# EAGLE design Badge Proto (EAGLE 9.2.2)
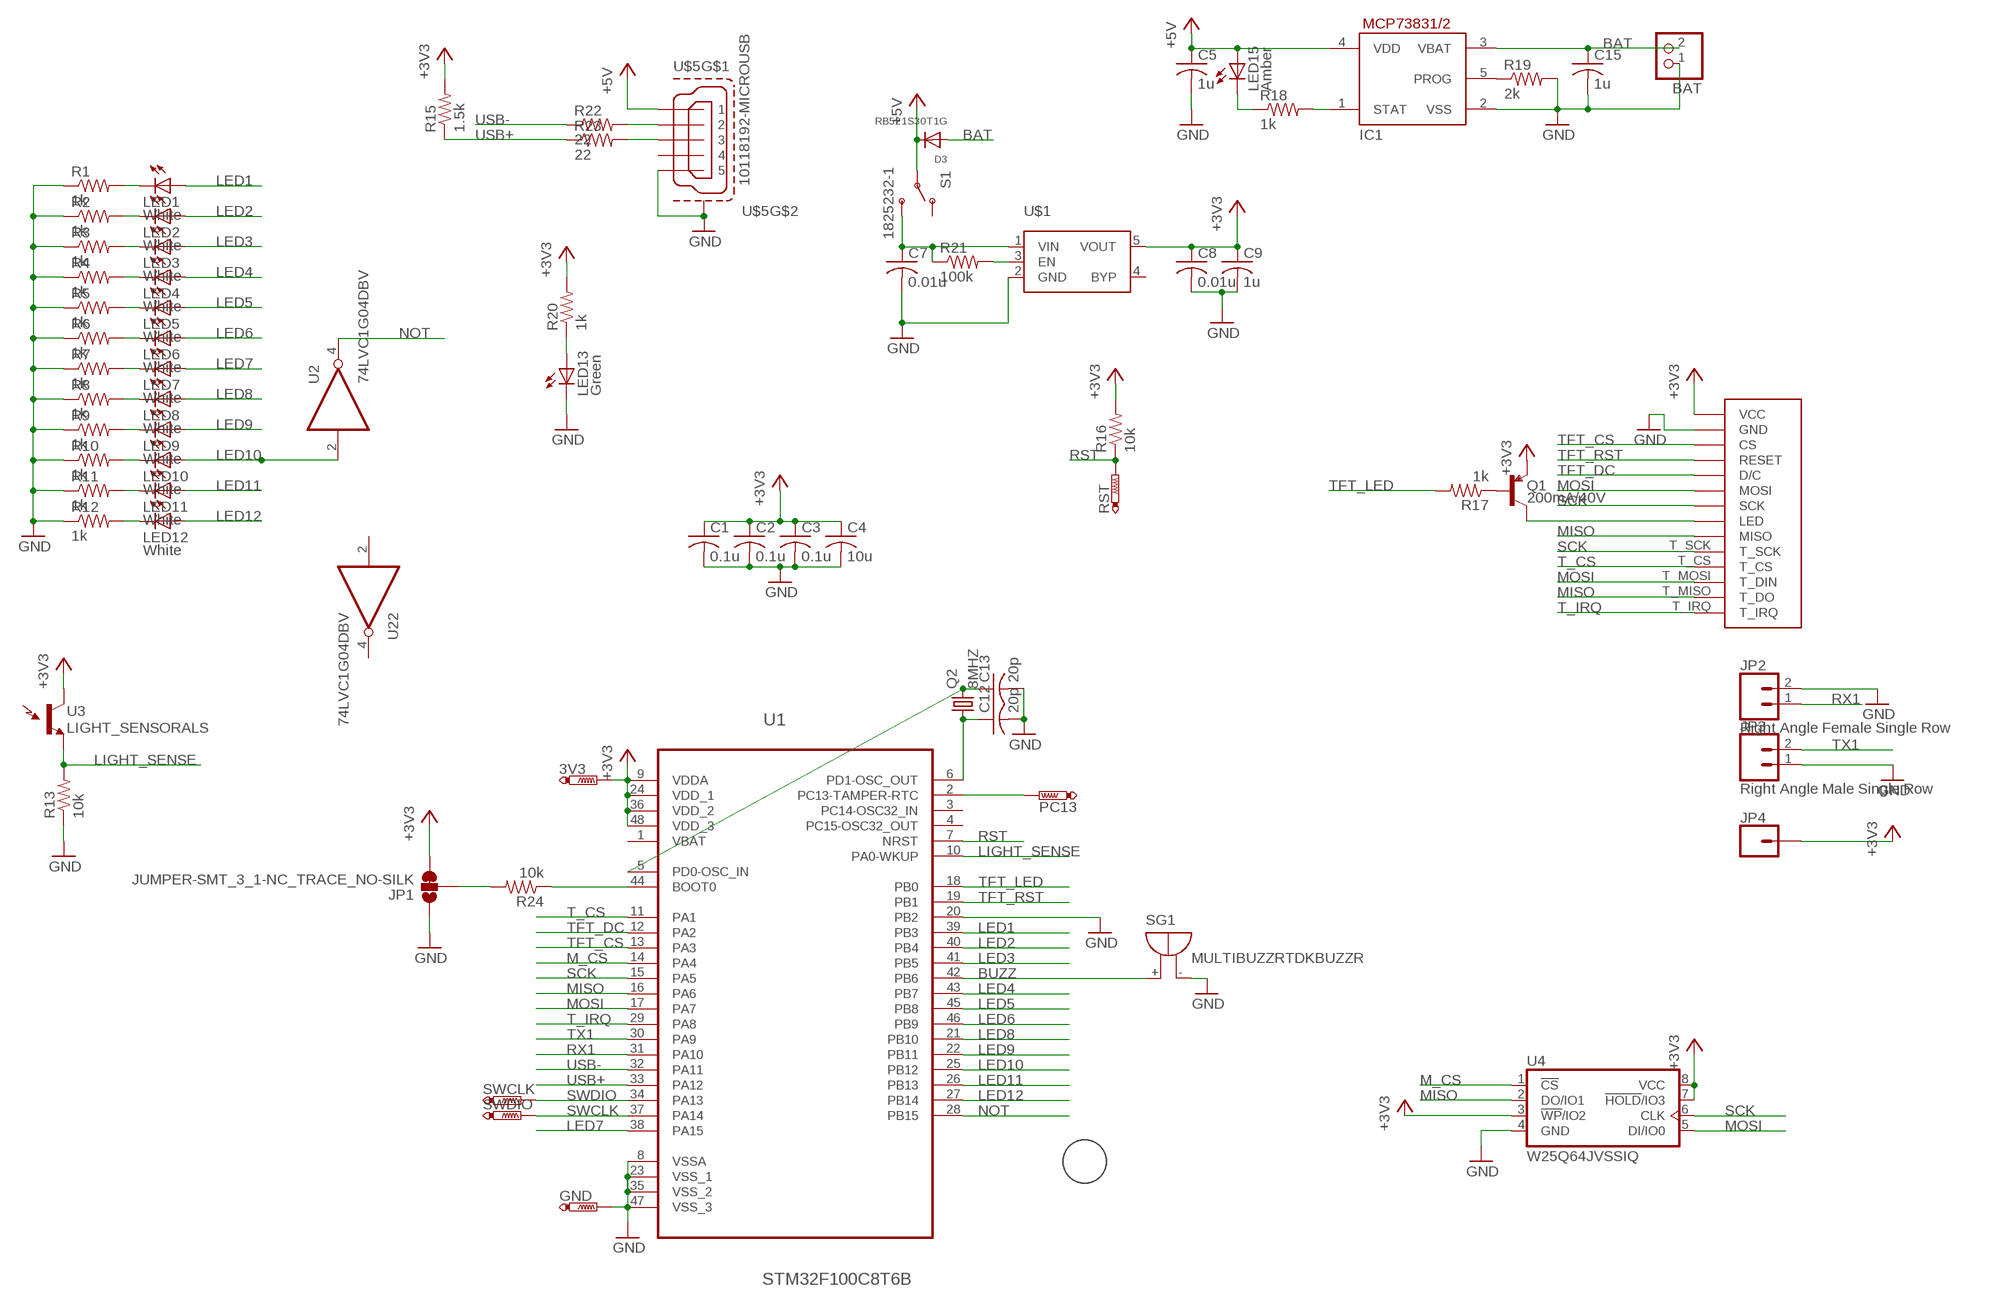
[diagram p0: schematic, sheet 1]

## Parts
3V3  PTR1TP15R  [TP15R]
BAT  JST_2PIN-THM-RA  [JST-PH-2-THM-RA]
C1  0.1u  C-USC0603K  [C0603K]
C2  0.1u  C-USC0603K  [C0603K]
C3  0.1u  C-USC0603K  [C0603K]
C4  10u  C-USC0603K  [C0603K]
C5  1u  C-USC0603K  [C0603K]
C7  0.01u  C-USC0603K  [C0603K]
C8  0.01u  C-USC0603K  [C0603K]
C9  1u  C-USC0603K  [C0603K]
C12  20p  C-USC0603K  [C0603K]
C13  20p  C-USC0603K  [C0603K]
C15  1u  C-USC0603K  [C0603K]
D3  RB521S30T1G  DIODESOD-523  [SOD-523]
GND  PTR1TP15R  [TP15R]
IC1  MCP73831/OT  [SOT23-5L]
J1  SPI_TFT_DISPLAY_TOUCH_NOSD  [SPI_DISPLAY_TOUCH_NOSD]
JP1  JUMPER-SMT_3_1-NC_TRACE_NO-SILK  [SMT-JUMPER_3_1-NC_TRACE_NO-SILK]
JP2  Right Angle Female Single Row  CONN_02PTH_RA_FEMALE  [1X02_RA_PTH_FEMALE]
JP3  Right Angle Male Single Row  CONN_02PTH_RA_FEMALE  [1X02_RA_PTH_FEMALE]
JP4  CONN_01PTH_NO_SILK_YES_STOP  [1X01_NO_SILK]
LED1  White  LEDSML0603  [SML0603]
LED2  White  LEDSML0603  [SML0603]
LED3  White  LEDSML0603  [SML0603]
LED4  White  LEDSML0603  [SML0603]
LED5  White  LEDSML0603  [SML0603]
LED6  White  LEDSML0603  [SML0603]
LED7  White  LEDSML0603  [SML0603]
LED8  White  LEDSML0603  [SML0603]
LED9  White  LEDSML0603  [SML0603]
LED10  White  LEDSML0603  [SML0603]
LED11  White  LEDSML0603  [SML0603]
LED12  White  LEDSML0603  [SML0603]
LED13  Green  LEDSML0603  [SML0603]
LED15  Amber  LEDSML0603  [SML0603]
PC13  PTR1TP15R  [TP15R]
Q1  200mA/40V  TRANS_PNP-PMBT3906|MMBT3906L  [SOT23-3]
Q2  8MHZ  CRYSTALHC49S  [HC49/S]
R1  1k  R-US_R0603  [R0603]
R2  1k  R-US_R0603  [R0603]
R3  1k  R-US_R0603  [R0603]
R4  1k  R-US_R0603  [R0603]
R5  1k  R-US_R0603  [R0603]
R6  1k  R-US_R0603  [R0603]
R7  1k  R-US_R0603  [R0603]
R8  1k  R-US_R0603  [R0603]
R9  1k  R-US_R0603  [R0603]
R10  1k  R-US_R0603  [R0603]
R11  1k  R-US_R0603  [R0603]
R12  1k  R-US_R0603  [R0603]
R13  10k  R-US_R0603  [R0603]
R15  1.5k  R-US_R0603  [R0603]
R16  10k  R-US_R0603  [R0603]
R17  1k  R-US_R0603  [R0603]
R18  1k  R-US_R0603  [R0603]
R19  2k  R-US_R0603  [R0603]
R20  1k  R-US_R0603  [R0603]
R21  100k  R-US_R0603  [R0603]
R22  22  R-US_R0603  [R0603]
R23  22  R-US_R0603  [R0603]
R24  10k  R-US_R0603  [R0603]
RST  PTR1TP15R  [TP15R]
S1  1825232-1  [1825232-1]
SG1  MULTIBUZZRTDKBUZZR  [BUZZRTDK]
SWCLK  PTR1TP15R  [TP15R]
SWDIO  PTR1TP15R  [TP15R]
U1  STM32F100C8T6B  [QFP50P900X900X160-48N]
U2  74LVC1G04DBV  [SOT23-5]
U3  LIGHT_SENSORALS  [ALS-PT19]
U4  W25Q64JVSSIQ  W25Q40BVSS  [SO08-SS]
U22  74LVC1G04DBV  [SOT23-5]
U$1  SPX3819  [SOT23-5]
U$4  PLUM  [PLUM]
U$5  10118192-MICROUSB  [MICROUSB-SMT]

## Nets
+3V3: 3V3.TP C1.1 C2.1 C3.1 C4.1 C8.1 C9.1 J1.VCC JP4.1 Q1.2(E) R15.2 R16.2 R20.2 U1.9(VDDA) U1.24(VDD_1) U1.36(VDD_2) U1.48(VDD_3) U3.C(C1) U4.3(!WP!/IO2) U4.7(!HOLD!/IO3) U4.8(VCC) U$1.5(VOUT)
+5V: C5.1 D3.K(C) IC1.4(VDD) LED15.A S1.2 U$5.P$1
BAT: BAT.2 C15.1 D3.A IC1.3(VBAT)
BUZZ: SG1.+ U1.42(PB6)
GND: BAT.1 C1.2 C2.2 C3.2 C4.2 C5.2 C7.2 C8.2 C9.2 C12.2 C13.2 C15.2 GND.TP IC1.2(VSS) J1.GND JP1.1 JP2.2 JP3.1 LED13.C R1.1 R2.1 R3.1 R4.1 R5.1 R6.1 R7.1 R8.1 R9.1 R10.1 R11.1 R12.1 R13.1 R19.2 SG1.- U1.8(VSSA) U1.20(PB2) U1.23(VSS_1) U1.35(VSS_2) U1.47(VSS_3) U4.4(GND) U$1.2(GND) U$5.P$5 U$5.SHLD@0(S4) U$5.SHLD@1(S4) U$5.SHLD@2(S4) U$5.SHLD@3(S4) U$5.SHLD@4(S4) U$5.SHLD@5(S4)
LED1: LED1.A U1.39(PB3)
LED2: LED2.A U1.40(PB4)
LED3: LED3.A U1.41(PB5)
LED4: LED4.A U1.43(PB7)
LED5: LED5.A U1.45(PB8)
LED6: LED6.A U1.46(PB9)
LED7: LED7.A U1.38(PA15)
LED8: LED8.A U1.21(PB10)
LED9: LED9.A U1.22(PB11)
LED10: LED10.A U1.25(PB12) U2.2(I)
LED11: LED11.A U1.26(PB13)
LED12: LED12.A U1.27(PB14)
LIGHT_SENSE: R13.2 U1.10(PA0-WKUP) U3.E(E1)
M_CS: U1.14(PA4) U4.1(!CS!)
MISO: J1.MISO J1.T_MISO(T_DO) U1.16(PA6) U4.2(DO/IO1)
MOSI: J1.MOSI J1.T_MOSI(T_DIN) U1.17(PA7) U4.5(DI/IO0)
N$1: LED1.C R1.2
N$2: LED2.C R2.2
N$3: LED3.C R3.2
N$4: LED4.C R4.2
N$5: LED5.C R5.2
N$6: LED6.C R6.2
N$7: LED7.C R7.2
N$8: LED8.C R8.2
N$9: LED9.C R9.2
N$10: R22.2 U$5.P$2
N$11: R23.2 U$5.P$3
N$12: R21.2 U$1.3(EN)
N$15: Q1.1(B) R17.1
N$16: IC1.5(PROG) R19.1
N$17: JP1.2 R24.2
N$19: C12.1 Q2.1 U1.6(PD1-OSC_OUT)
N$21: C13.1 Q2.2 U1.5(PD0-OSC_IN)
N$22: LED15.C R18.1
N$23: IC1.1(STAT) R18.2
N$24: LED10.C R10.2
N$25: LED11.C R11.2
N$26: LED12.C R12.2
N$28: LED13.A R20.1
N$29: C7.1 R21.1 S1.1 U$1.1(VIN)
N$41: R24.1 U1.44(BOOT0)
N$42: PC13.TP U1.2(PC13-TAMPER-RTC)
NOT: U1.28(PB15) U2.4(O)
NS1: J1.LED Q1.3(C)
RST: R16.1 RST.TP U1.7(NRST)
RX1: JP2.1 U1.31(PA10)
SCK: J1.SCK J1.T_SCK U1.15(PA5) U4.6(CLK)
SWCLK: SWDIO.TP U1.37(PA14)
SWDIO: SWCLK.TP U1.34(PA13)
T_CS: J1.T_CS U1.11(PA1)
T_IRQ: J1.T_IRQ U1.29(PA8)
TFT_CS: J1.CS U1.13(PA3)
TFT_DC: J1.D/C U1.12(PA2)
TFT_LED: R17.2 U1.18(PB0)
TFT_RST: J1.RESET U1.19(PB1)
TX1: JP3.2 U1.30(PA9)
USB+: R15.1 R23.1 U1.33(PA12)
USB-: R22.1 U1.32(PA11)
Unconnected: JP1.3 S1.3 U1.3(PC14-OSC32_IN) U1.4(PC15-OSC32_OUT) U22.2(I) U22.4(O) U$1.4(BYP) U$5.P$4

## Power pins joined to a net without a drawn wire
+3V3: U2.5(VCC) U22.5(VCC)
GND: U2.3(GND) U22.3(GND)
VBAT: U1.1(VBAT)

## Library data of the parts
3V3 GND PC13 RST SWCLK SWDIO = testpad:PTR1: TEST PIN
BAT = adafruit:JST_2PIN: JST 2-Pin Connectors of various flavors SMT-RA (S2B-PH-SM4) 4UConnector #17311 SMT (B2B-PH-SM4) THM-RA (S2B-PH) THM (B2B-PH); OC_NEWARK: unknown
C1-C3 = resistor:C-US: CAPACITOR, American symbol; MPN: MC0603B104K160CT; OC_NEWARK: 06R4923
C4 = resistor:C-US: CAPACITOR, American symbol; MPN: C1608X5R1A106K080AC; OC_NEWARK: 04X3243
C5 C9 C15 = resistor:C-US: CAPACITOR, American symbol; MF: KEMET; MPN: C0603C104K8RACTU; OC_NEWARK: 62H0320
C7 C8 C12 C13 = resistor:C-US: CAPACITOR, American symbol; OC_NEWARK: unknown
D3 = adafruit:DIODE: Diode SMADIODE - SMA Surface Mount Package 20V 1A Schottky Diode Digikey: 641-1014-6-ND DO-1N4148 - Through Hole Small Current Diode SOD-123 20V 1 A (.5mV Vf) Schottky Diode - Digikey: MBRX120TPMSCT-ND SOD-323 10V 570mA (.38mV Vf, 3ns) Schottky Diode - Digikey: ZLLS410CT-ND SOD-523 30V 30mA Schottky Diode (RB751S-40TE61) - Digikey: RB751S-40TE61CT-ND SOT23-R/W - SOT23 Package (R = Solder Paste/Reflow Ovens, W = Hand-Soldering) BAT54Film 40V 300mA - Digikey: 497-7162-1-ND; MPN: 1N4148WT.; OC_NEWARK: 26AC5787
IC1 = adafruit:MCP73831: MCP73831/2 Miniature Single-Cell, Fully Integrated Li-Ion, Li-Polymer Charge Management Controllers. Nice and small simple lipoly charge controller, with adjustable current and status output (LED) http://www.ladyada.net/library/pcb/eaglelibrary.html
J1 = Grange:SPI_TFT_DISPLAY_TOUCH_NOSD: SPI TFT Display with touch Connector for the cheap 2.4"/2.8" Serial SPI TFT displays with touch found on eBay.
JP1 = SparkFun-Jumpers:JUMPER-SMT_3_1-NC_TRACE: Normally closed trace jumper (1 of 2 connections) This jumper has a trace between two pads so it's normally closed (NC). The other connection is normally open (NO). Use a razor knife to open the connection. For best results follow the IPC guidelines for cutting traces: Cutout at least 0.063 mm (0.005 in). Remove all loose material to clean up the cut area. Seal the cut with an approved epoxy. Reapply solder to reclose the connection, or to close the NO connection.
JP2 JP3 = SparkFun-Connectors:CONN_02: Multi connection point. Often used as Generic Header-pin footprint for 0.1 inch spaced/style header connections On any of the 0.1 inch spaced packages, you can populate with these: Break Away Headers - Straight (PRT-00116) Break Away Male Headers - Right Angle (PRT-00553) Female Headers (PRT-00115) Break Away Headers - Machine Pin (PRT-00117) Break Away Female Headers - Swiss Machine Pin (PRT-00743) For SCREWTERMINALS and SPRING TERMINALS visit here: Screw Terimnals on SparkFun.com (5mm/3.5mm/2.54mm spacing) This device is also useful as a general connection point to wire up your design to another part of your project. Our various solder wires solder well into these plated through hole pads. Hook-Up Wire - Assortment (Stranded, 22 AWG) (PRT-11375) Hook-Up Wire - Assortment (Solid Core, 22 AWG) (PRT-11367) View the entire wire category on our website here Special notes: Molex polarized connector foot print use with: PRT-08233 with associated crimp pins and housings. 2.54_SCREWTERM for use with PRT-10571. 3.5mm Screw Terminal footprints for PRT-08084 5mm Screw Terminal footprints for use with PRT-08432; PROD_ID: CONN-13700
JP4 = SparkFun-Connectors:CONN_01: Single connection point. Often used as Generic Header-pin footprint for 0.1 inch spaced/style header connections On any of the 0.1 inch spaced packages, you can populate with these: Break Away Headers - Straight (PRT-00116) Break Away Male Headers - Right Angle (PRT-00553) Female Headers (PRT-00115) Break Away Headers - Machine Pin (PRT-00117) Break Away Female Headers - Swiss Machine Pin (PRT-00743) This device is also useful as a general connection point to wire up your design to another part of your project. Our various solder wires solder well into these plated through hole pads. Hook-Up Wire - Assortment (Stranded, 22 AWG) (PRT-11375) Hook-Up Wire - Assortment (Solid Core, 22 AWG) (PRT-11367) View the entire wire category on our website here Special notes: SMTSO-256-ET is a "flush mount" nut for a 4-40 screw. We mostly use this on specialty testbeds; it is a nice way to connect hardware to your PCB at an adjustable hieght. Also note, the SNAP packages are for using a snappable style connector. We sell a baggie of snaps and they are also used on two LilyPad designs: Snap Assortment - 30 pack (male and female) (DEV-11347) LilyPad Arduino SimpleSnap (DEV-10941) LilyPad SimpleSnap Protoboard (DEV-10940); OC_NEWARK: unknown
LED1-LED13 = led:LED: LED OSRAM: - CHIPLED LG R971, LG N971, LY N971, LG Q971, LY Q971, LO R971, LY R971 LH N974, LH R974 LS Q976, LO Q976, LY Q976 LO Q996 - Hyper CHIPLED LW Q18S LB Q993, LB Q99A, LB R99A - SideLED LS A670, LO A670, LY A670, LG A670, LP A670 LB A673, LV A673, LT A673, LW A673 LH A674 LY A675 LS A676, LA A676, LO A676, LY A676, LW A676 LS A679, LY A679, LG A679 - Hyper Micro SIDELED® LS Y876, LA Y876, LO Y876, LY Y876 LT Y87S - SmartLED LW L88C, LW L88S LB L89C, LB L89S, LG L890 LS L89K, LO L89K, LY L89K LS L896, LA L896, LO L896, LY L896 - TOPLED LS T670, LO T670, LY T670, LG T670, LP T670 LSG T670, LSP T670, LSY T670, LOP T670, LYG T670 LG T671, LOG T671, LSG T671 LB T673, LV T673, LT T673, LW T673 LH T674 LS T676, LA T676, LO T676, LY T676, LB T676, LH T676, LSB T676, LW T676 LB T67C, LV T67C, LT T67C, LS T67K, LO T67K, LY T67K, LW E67C LS E67B, LA E67B, LO E67B, LY E67B, LB E67C, LV E67C, LT E67C LW T67C LS T679, LY T679, LG T679 LS T770, LO T770, LY T770, LG T770, LP T770 LB T773, LV T773, LT T773, LW T773 LH T774 LS E675, LA E675, LY E675, LS T675 LS T776, LA T776, LO T776, LY T776, LB T776 LHGB T686 LT T68C, LB T68C - Hyper Mini TOPLED® LB M676 - Mini TOPLED Santana® LG M470 LS M47K, LO M47K, LY M47K Source: http://www.osram.convergy.de LUXEON: - LUMILED® LXK2-PW12-R00, LXK2-PW12-S00, LXK2-PW14-U00, LXK2-PW14-V00 LXK2-PM12-R00, LXK2-PM12-S00, LXK2-PM14-U00 LXK2-PE12-Q00, LXK2-PE12-R00, LXK2-PE12-S00, LXK2-PE14-T00, LXK2-PE14-U00 LXK2-PB12-K00, LXK2-PB12-L00, LXK2-PB12-M00, LXK2-PB14-N00, LXK2-PB14-P00, LXK2-PB14-Q00 LXK2-PR12-L00, LXK2-PR12-M00, LXK2-PR14-Q00, LXK2-PR14-R00 LXK2-PD12-Q00, LXK2-PD12-R00, LXK2-PD12-S00 LXK2-PH12-R00, LXK2-PH12-S00 LXK2-PL12-P00, LXK2-PL12-Q00, LXK2-PL12-R00 Source: www.luxeon.com KINGBRIGHT: KA-3528ASYC Source: www.kingbright.com
LED15 = led:LED: LED OSRAM: - CHIPLED LG R971, LG N971, LY N971, LG Q971, LY Q971, LO R971, LY R971 LH N974, LH R974 LS Q976, LO Q976, LY Q976 LO Q996 - Hyper CHIPLED LW Q18S LB Q993, LB Q99A, LB R99A - SideLED LS A670, LO A670, LY A670, LG A670, LP A670 LB A673, LV A673, LT A673, LW A673 LH A674 LY A675 LS A676, LA A676, LO A676, LY A676, LW A676 LS A679, LY A679, LG A679 - Hyper Micro SIDELED® LS Y876, LA Y876, LO Y876, LY Y876 LT Y87S - SmartLED LW L88C, LW L88S LB L89C, LB L89S, LG L890 LS L89K, LO L89K, LY L89K LS L896, LA L896, LO L896, LY L896 - TOPLED LS T670, LO T670, LY T670, LG T670, LP T670 LSG T670, LSP T670, LSY T670, LOP T670, LYG T670 LG T671, LOG T671, LSG T671 LB T673, LV T673, LT T673, LW T673 LH T674 LS T676, LA T676, LO T676, LY T676, LB T676, LH T676, LSB T676, LW T676 LB T67C, LV T67C, LT T67C, LS T67K, LO T67K, LY T67K, LW E67C LS E67B, LA E67B, LO E67B, LY E67B, LB E67C, LV E67C, LT E67C LW T67C LS T679, LY T679, LG T679 LS T770, LO T770, LY T770, LG T770, LP T770 LB T773, LV T773, LT T773, LW T773 LH T774 LS E675, LA E675, LY E675, LS T675 LS T776, LA T776, LO T776, LY T776, LB T776 LHGB T686 LT T68C, LB T68C - Hyper Mini TOPLED® LB M676 - Mini TOPLED Santana® LG M470 LS M47K, LO M47K, LY M47K Source: http://www.osram.convergy.de LUXEON: - LUMILED® LXK2-PW12-R00, LXK2-PW12-S00, LXK2-PW14-U00, LXK2-PW14-V00 LXK2-PM12-R00, LXK2-PM12-S00, LXK2-PM14-U00 LXK2-PE12-Q00, LXK2-PE12-R00, LXK2-PE12-S00, LXK2-PE14-T00, LXK2-PE14-U00 LXK2-PB12-K00, LXK2-PB12-L00, LXK2-PB12-M00, LXK2-PB14-N00, LXK2-PB14-P00, LXK2-PB14-Q00 LXK2-PR12-L00, LXK2-PR12-M00, LXK2-PR14-Q00, LXK2-PR14-R00 LXK2-PD12-Q00, LXK2-PD12-R00, LXK2-PD12-S00 LXK2-PH12-R00, LXK2-PH12-S00 LXK2-PL12-P00, LXK2-PL12-Q00, LXK2-PL12-R00 Source: www.luxeon.com KINGBRIGHT: KA-3528ASYC Source: www.kingbright.com; MPN: ASMT-RJ45-AQ502; OC_NEWARK: 97Y1013
Q1 = SparkFun-DiscreteSemi:TRANS_PNP: PNP transistor Current controlled devices typically used to amplify current or used as a switch. SparkFun Products: SparkFun Serial Enabled 16x2 LCD - Red on Black <https://www.sparkfun.com/products/9068> SparkFun Logomatic <https://www.sparkfun.com/products/12772>; OC_NEWARK: unknown; PROD_ID: TRANS-08052
Q2 = adafruit:CRYSTAL: CRYSTAL; OC_FARNELL: 1667008; OC_NEWARK: unknown
R1-R12 R17 R18 R20 = resistor:R-US_: RESISTOR, American symbol; MPN: ERJ-3GEYJ912V; OC_NEWARK: 65T8700
R13 R16 R24 = resistor:R-US_: RESISTOR, American symbol; MF: OUTSOURCE ITEM; MPN: RR0816P-103-D; OC_NEWARK: 28K0421
R15 = resistor:R-US_: RESISTOR, American symbol; MPN: MC0603SAF1501T5E; OC_NEWARK: 79M5919
R19 = resistor:R-US_: RESISTOR, American symbol; MPN: ERJ-6ENF2001V; OC_NEWARK: 65T8715
R21 = resistor:R-US_: RESISTOR, American symbol; MPN: MC0603SAF1003T5E; OC_NEWARK: 04P0211
R22 R23 = resistor:R-US_: RESISTOR, American symbol; MPN: ERJ-3GEYJ220V; OC_NEWARK: 65T8602
S1 = TE Connectivity:1825232-1
SG1 = buglbr:MULTIBUZZR: BUZZER TDK PS1720P02 http://de.mouser.com/ProductDetail/TDK/PS1720P02/?qs=%2fha2pyFadujtCAfY3DKBdXuzQLwQogEgrqwqrrNaKDmjrMwApyDRCA%3d%3d
U1 = ST Microelctronics_By_element14_Batch_1:STM32F100C8T6B: ARM-based 32-bit MCU; MPN: STM32F100C8T6B; OC_FARNELL: 1838511; OC_NEWARK: 76R0988; PACKAGE: LQFP-48; SUPPLIER: STMircroelectronics
U2 U22 = 74xx-little-us:74*1G04: INVERTER Gate; MPN: SN74LVC1G04DBVR; OC_NEWARK: 12X9054
U3 = SparkFun-Sensors:LIGHT_SENSOR: Ambient Light Sensors - Phototransistors Low cost ambient light sensors, consisting of a phototransistor in miniature SMD packages. Output voltage varies with light intensity. SparkFun Products ALS-PT19 Light Sensor (SEN-12566) Ambient Light Sensor - TEMT6000 (SEN-08348) SparkFun Ambient Light Sensor Breakout - TEMT60000 (SEN-08688); PROD_ID: IC-11836; SF_ID: SEN-12566
U4 = memory-winbond:W25Q40BV: EEPROM 4 Mbit SPI Serial Flash with Dual and Quad SPI
U$1 = kanflo:SPX3819: SPX3819 500mA LDO Voltage Regulator
U$4 = Grange:PLUM
U$5 = FCI-10118192-microusb:10118192-MICROUSB; MPN: 10118192-0002LF; OC_NEWARK: 53Y2334

## Board
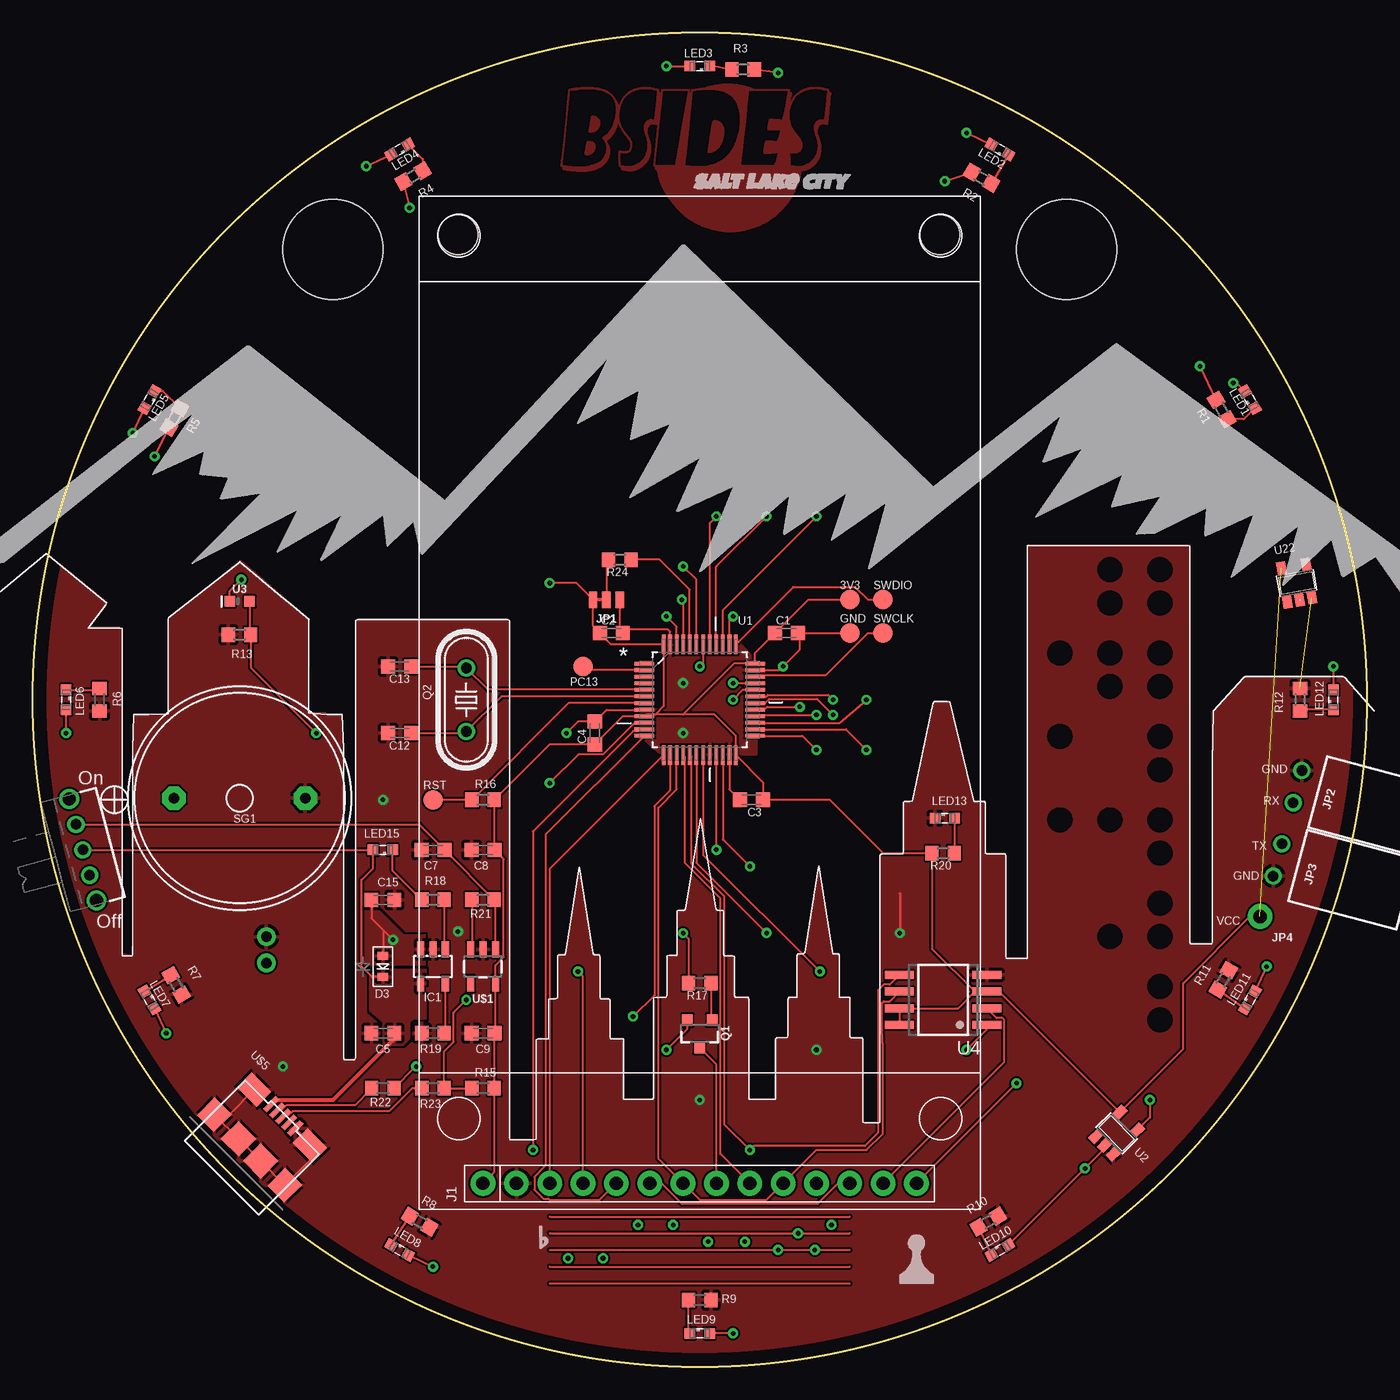
[diagram p1: board, top side]
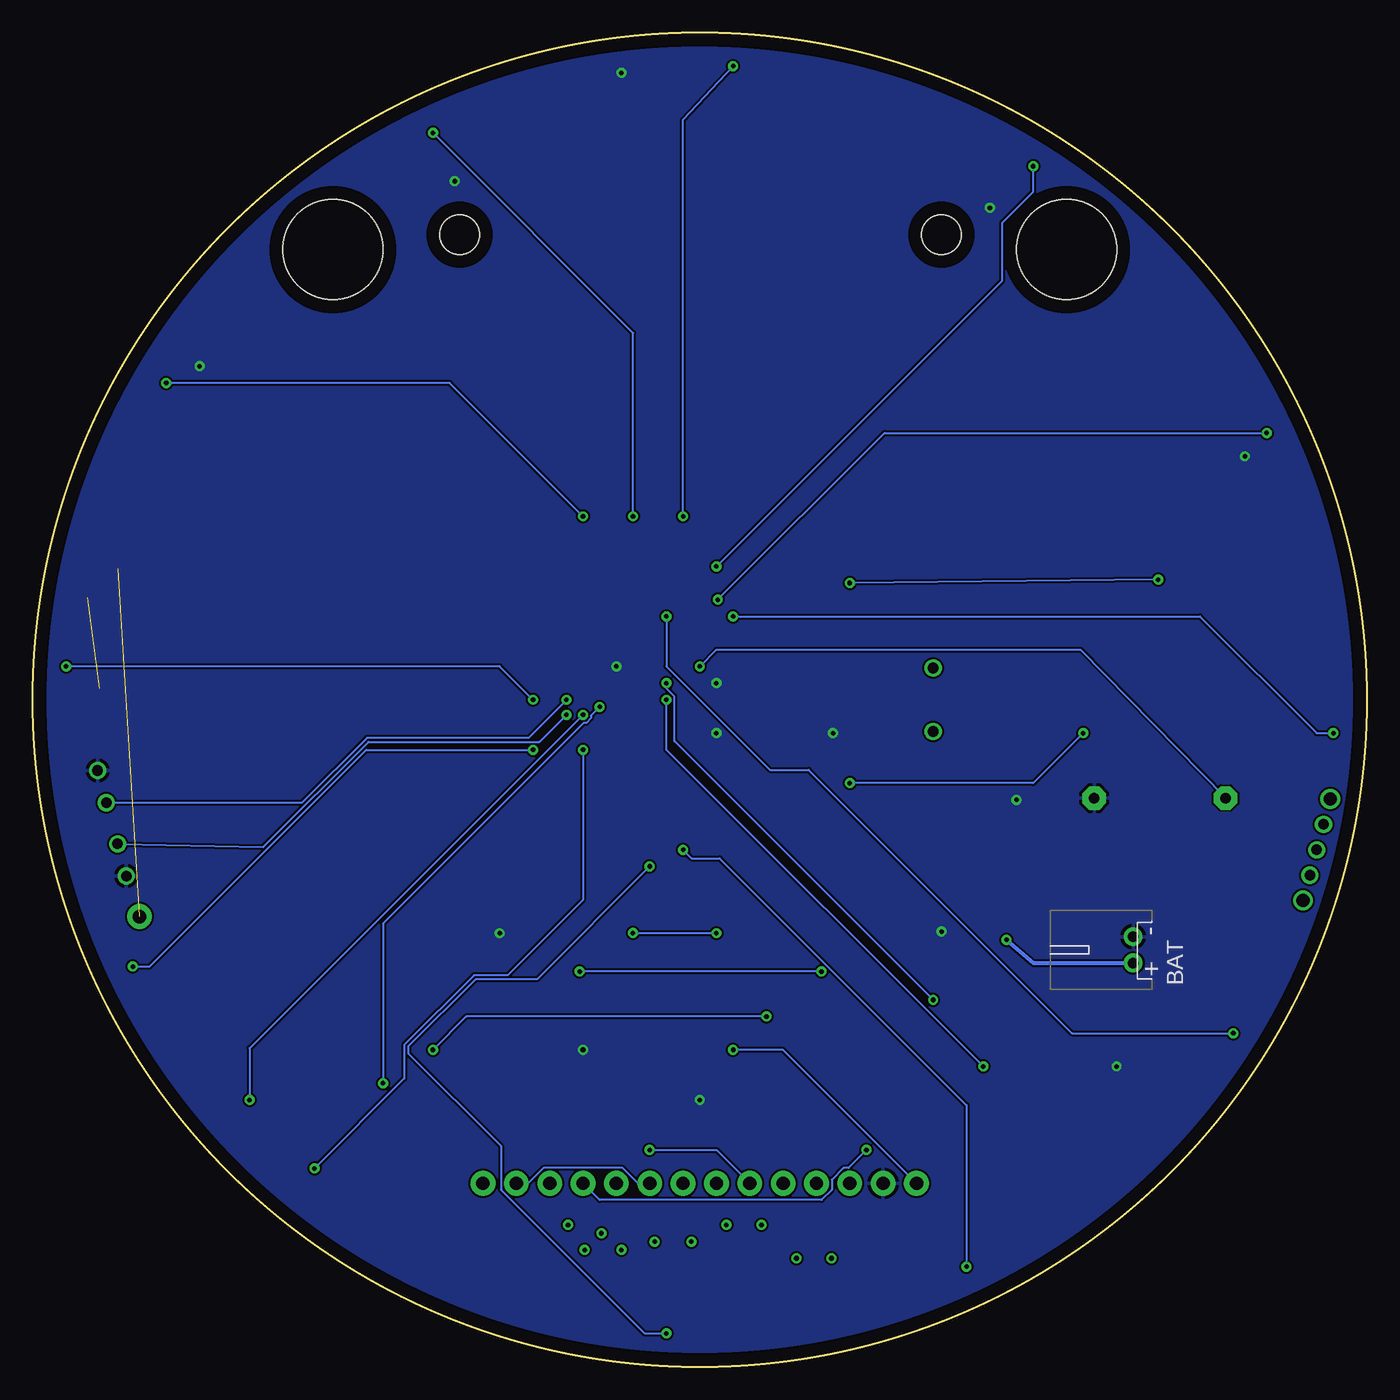
[diagram p2: board, bottom side, seen from below]

Size 101.6 x 101.6 mm. Coordinates in mm from the lower left corner, seen from the top.
Outline: circle at 50.8,50.8 radius 50.8
Copper layers (1*16): Top 0.035mm / dielectric 1.5mm / Bottom 0.035mm
Design rules "default": minimum track width 6mil, minimum drill 0.35mm, track to track 6mil, track to pad 6mil, pad to pad 6mil, via to via 6mil, smd to smd 6mil, copper to edge 40mil, drill to drill 6mil, minimum pad ring 10mil, minimum via ring 8mil, stop-mask expansion 4mil, vias tented up to drill 0mil, thermal gap 10mil
Holes 7.62 mm at 22.86,85.09 78.74,85.09
Holes 3 mm at 32.38,86.23 69.09,86.23
tRestrict: area 81.1,59.8 to 82.9,61.6; area 85,59.8 to 86.7,61.6; area 81.1,57.3 to 82.9,59.1; area 85,57.3 to 86.7,59.1; area 77.3,53.5 to 79.1,55.3; area 81.1,53.5 to 82.9,55.3; area 85,53.5 to 86.7,55.3; area 81.1,50.9 to 82.9,52.7; area 85,50.9 to 86.7,52.7; area 77.3,47.1 to 79.1,48.9; area 85,47.1 to 86.7,48.9; area 85,44.6 to 86.7,46.4; 15 more areas

### Footprints (pad centres in the part's own frame; a part is rotated, then mirrored left to right if it is on the bottom)
TP15R = smd 1.5 x 1.5: TP 0,0
JST-PH-2-THM-RA = drill 0.8 pad 1.422: 1 1,0; 2 -1,0
C0603K = smd 1.05 x 1.08: 1 -0.875,0; 2 0.875,0
SOD-523 = smd 0.8 x 0.6: A 0,-0.8; K 0,0.8
SOT23-5L = smd 0.55 x 1.2: 1 -0.95,-1.3; 2 0,-1.3; 3 0.95,-1.3; 4 0.95,1.3; 5 -0.95,1.3
SPI_DISPLAY_TOUCH_NOSD = drill 1.016 pad 1.88: CS 0,7.62; D/C 0,2.54; GND 0,10.16; LED 0,-5.08; MISO 0,-7.62; MOSI 0,0; RESET 0,5.08; SCK 0,-2.54; T_CS 0,-12.7; T_IRQ 0,-20.32; T_MISO 0,-17.78; T_MOSI 0,-15.24; T_SCK 0,-10.16; VCC 0,12.7
SMT-JUMPER_3_1-NC_TRACE_NO-SILK = smd 0.635 x 1.27: 1 -1.016,0; 2 0,0; 3 1.016,0
1X02_RA_PTH_FEMALE = drill 0.8: 1 1.27,-5.85; 2 -1.27,-5.85
1X01_NO_SILK = drill 1.016 pad 1.88: 1 0,0
SML0603 = smd 0.8 x 0.8: A 0.75,0; C -0.75,0
SOT23-3 = smd 0.8 x 0.9: 1 -0.95,-1; 2 0.95,-1; 3 0,1.1
HC49/S = drill 0.813: 1 -2.413,0; 2 2.413,0
R0603 = smd 1 x 1.1: 1 -0.85,0; 2 0.85,0
1825232-1 = drill 0.8: 1 -2,0; 2 0,0; 3 2,0 | drill 1: P$1 -4,0; P$2 4,0
BUZZRTDK = drill 0.8 pad 1.8 octagon: + 5,0; - -5,0
QFP50P900X900X160-48N = smd 1.473 x 0.279: 1 -4.216,2.743; 2 -4.216,2.261; 3 -4.216,1.753; 4 -4.216,1.245; 5 -4.216,0.762; 6 -4.216,0.254; 7 -4.216,-0.254; 8 -4.216,-0.762; 9 -4.216,-1.245; 10 -4.216,-1.753; 11 -4.216,-2.261; 12 -4.216,-2.743; 25 4.216,-2.743; 26 4.216,-2.261; 27 4.216,-1.753; 28 4.216,-1.245; 29 4.216,-0.762; 30 4.216,-0.254; 31 4.216,0.254; 32 4.216,0.762; 33 4.216,1.245; 34 4.216,1.753; 35 4.216,2.261; 36 4.216,2.743 | smd 0.279 x 1.473: 13 -2.743,-4.216; 14 -2.261,-4.216; 15 -1.753,-4.216; 16 -1.245,-4.216; 17 -0.762,-4.216; 18 -0.254,-4.216; 19 0.254,-4.216; 20 0.762,-4.216; 21 1.245,-4.216; 22 1.753,-4.216; 23 2.261,-4.216; 24 2.743,-4.216; 37 2.743,4.216; 38 2.261,4.216; 39 1.753,4.216; 40 1.245,4.216; 41 0.762,4.216; 42 0.254,4.216; 43 -0.254,4.216; 44 -0.762,4.216; 45 -1.245,4.216; 46 -1.753,4.216; 47 -2.261,4.216; 48 -2.743,4.216
SOT23-5 = smd 0.69 x 0.99: 1 -0.95,-1.29; 2 0,-1.29; 3 0.95,-1.29; 4 0.95,1.3; 5 -0.95,1.3
ALS-PT19 = smd 0.8 x 0.8: C -0.75,0; E 0.75,0
SO08-SS = smd 0.6 x 2.2: 1 -1.905,-3.33; 2 -0.635,-3.33; 3 0.635,-3.33; 4 1.905,-3.33; 5 1.905,3.33; 6 0.635,3.33; 7 -0.635,3.33; 8 -1.905,3.33
SOT23-5' = smd 0.55 x 1.2: 1 -0.95,-1.3; 2 0,-1.3; 3 0.95,-1.3; 4 0.95,1.3; 5 -0.95,1.3
MICROUSB-SMT = smd 0.4 x 1.35: P$1 -1.3,3.625; P$2 -0.65,3.625; P$3 0,3.625; P$4 0.65,3.625; P$5 1.3,3.625 | smd 2.1 x 1.6: SHLD@0 -3,3.5; SHLD@1 3,3.5 | smd 1.8 x 1.9: SHLD@2 -3.8,0; SHLD@5 3.8,0 | smd 1.9 x 1.9: SHLD@3 -1.2,0; SHLD@4 1.2,0

### Placement (x,y rotation side)
3V3  62.23,58.42 0 top
BAT  17.78,31.75 90 bottom
C1  57.4,55.88 0 top
C2  44.07,55.88 0 top
C3  54.74,43.18 180 top
C4  42.8,48.26 90 top
C5  26.67,25.4 180 top
C7  30.48,39.37 180 top
C8  34.29,39.37 180 top
C9  34.29,25.4 180 top
C12  27.94,48.26 180 top
C13  27.94,53.34 180 top
C15  26.67,35.56 0 top
D3  26.67,30.48 180 top
GND  62.23,55.88 0 top
IC1  30.48,30.48 180 top
J1  46.99,13.97 90 top
JP1  43.69,58.42 180 top
JP2  101.98,42.67 255 top
JP3  100.46,37.08 255 top
JP4  93.47,34.29 0 top
LED1  92.71,73.66 120 top
LED2  73.66,92.71 150 top
LED3  50.8,99.06 180 top
LED4  27.94,92.71 210 top
LED5  8.89,73.66 240 top
LED6  2.54,50.8 270 top
LED7  8.89,27.94 300 top
LED8  27.94,8.89 330 top
LED9  50.8,2.54 0 top
LED10  73.66,8.89 30 top
LED11  92.71,27.94 60 top
LED12  99.06,50.8 90 top
LED13  69.47,41.78 0 top
LED15  26.67,39.37 180 top
PC13  41.91,53.34 0 top
Q1  50.8,25.4 180 top
Q2  33.02,50.8 90 top
R1  90.55,72.9 300 top
R2  72.26,90.55 330 top
R3  54.1,98.81 180 top
R4  28.96,90.68 30 top
R5  10.79,72.26 60 top
R6  5.08,50.8 90 top
R7  10.92,29.08 120 top
R8  29.46,11.05 150 top
R9  50.8,5.08 180 top
R10  72.77,11.05 210 top
R11  90.68,29.46 240 top
R12  96.52,50.8 270 top
R13  15.75,55.75 0 top
R15  34.29,21.21 0 top
R16  34.29,43.18 0 top
R17  50.8,29.21 180 top
R18  30.48,35.56 0 top
R19  30.48,25.4 180 top
R20  69.34,39.12 180 top
R21  34.29,35.56 180 top
R22  26.67,21.21 180 top
R23  30.48,21.21 180 top
R24  44.7,61.47 180 top
RST  30.48,43.18 0 top
S1  3.81,39.37 285 top
SG1  15.75,43.31 180 top
SWCLK  64.77,55.88 0 top
SWDIO  64.77,58.42 0 top
U1  50.8,50.8 0 top
U2  82.55,17.78 315 top
U3  15.75,58.29 0 top
U4  69.34,27.94 90 top
U22  96.27,59.69 10 top
U$1  SPX3819  [SOT23-5']  34.29,30.48 180 top
U$4  67.31,6.35 0 top
U$5  16.51,16.51 315 top

### Tracks (layer width: path | path; a pad name or v marks a point on that pad's centre or on a via)
+3V3  (via drill 0.35)  (1 unrouted)
  Top 0.152: U4.8 U4.7 70.48,27.3 71.75,28.57 | J1.VCC 35.14,14.82 R15.2 35.16,21.23 C9.1 35.24,25.47 U$1.5 35.24,30.58 35.87,31.21 35.87,38.67 C8.1 35.14,39.39 R16.2 39.34,47.38 C4.1 44.97,49.55 U1.9 46.7,49.67 47.41,49.67 | 3V3.TP 59.07,58.42 C1.1 55.02,54.37 U1.36 53.4,53.54 49.53,49.67 | 64.76,39.12 64.77,39.12 | 64.77,39.12 R20.2 68.49,31.84 71.75,28.57 | 71.75,28.57 U4.3 73.59,28.57 U2.5 87.63,24.2 87.63,29.21 92.71,34.29 JP4.1 | v48.26,24.13 49.85,25.72 Q1.2 | 47.41,49.67 48.06,50.31 U1.48 44.06,55.02 C2.1 42.67,56.4 42.67,58.42 41.4,59.69 v39.37,59.69 | 49.53,49.67 51.93,49.67 53.54,48.06 U1.24 55.61,44.52 C3.1 60.71,43.18 64.77,39.12 | 49.53,49.67 47.41,49.67 | U3.C 15,59.07 v15.88,59.94
  Bottom 0.152: J1.VCC 44.45,24.13 v48.26,24.13 | v15.88,59.94 v39.37,59.69
+5V
  Top 0.152: D3.K 25.84,29.68 25.04,30.48 25.04,37.08 25.92,37.95 LED15.A S1.2
  Top 0.305: U$5.P$1 18.48,20.32 22.86,20.32 27.54,25 C5.1
  pour Top: 29.97,30.23 26.16,30.23 25.65,29.72 25.65,27.18 26.67,26.29 26.67,24.51 28.19,24.51 28.7,25.02 28.7,26.29 28.96,26.54 29.97,26.54
BAT  (via drill 0.35)
  Top 0.152: D3.A 26.67,33.27 v27.43,32.51 25.79,34.15 C15.1
  Bottom 0.305: v27.43,32.51 25.38,30.75 BAT.2
  pour Top: 29.84,30.61 25.27,30.61 25.27,35.81 28.19,32.89 29.84,32.89
BUZZ  (via drill 0.35)
  Top 0.152: U1.42 51.05,53.59 v50.8,53.34
  Bottom 0.152: v50.8,53.34 49.53,54.61 21.8,54.61 SG1.+
GND  (via drill 0.35)  (1 unrouted)
  Top 0.152: U$5.P$5 21.11,17.04 U$5.SHLD@1 21.11,15.73 U$5.SHLD@5 U$5.SHLD@4 U$5.SHLD@3 U$5.SHLD@2 14.95,19.2 U$5.SHLD@0 | C1.2 58.42,55.88 | 58.42,55.88 GND.TP | U1.8 43.7,50.04 C4.2 41.52,49.13 v40.64,48.26 | 66.04,36.08 v66.04,33.02 | U1.35 56.87,53.06 v57.15,53.34 58.42,54.61 58.42,55.88 | v9.27,69.34 R5.1 | R4.1 v28.7,88.27 | v56.77,98.55 R3.1 | v69.47,90.3 R2.1 | v88.9,76.2 R1.1 | JP1.1 44.7,56.12 44.89,55.94 | 44.89,55.94 C2.2 | U1.47 48.54,55.98 48.39,56.13 45.08,56.13 44.89,55.94 | U1.23 53.06,43.98 C3.2
  other vias: 59.69,24.13 50.8,20.32 26.67,43.18 49.53,52.07 49.53,48.26 19.05,22.86 32.38,33.15
  pour Bottom (rank 3): -1.27,73.66 30.48,105.41 73.66,105.41 74.93,104.14 104.14,74.93 104.14,27.94 73.66,-2.54 27.94,-2.54 -1.27,26.67
  pour Top (rank 3): 1.01,61.92 -3.27,58.39 -1.91,58.23 -1.7,56.34 -1.71,56.25 -1.97,56.25 -2.03,56.1 -3.3,2.31 -3.19,0.95 99.6,0.15 102.26,4.04 102.26,44.69 102.19,49.94 99.94,52.49 99.77,52.55 92.37,52.55 92.22,52.44 89.92,49.93 89.85,49.76 89.85,32.37 89.81,32.21 88.21,32.21 88.13,32.33 88.13,62.51 87.96,62.54 75.96,62.54 75.77,62.53 75.77,31.29 75.76,31.1 74.16,31.1 74.11,31.25 74.11,38.89 74.08,39.05 72.68,39.05 72.54,39.12 72.54,42.92 72.47,43.04 71.87,43.04 71.68,43.05 69.85,50.64 69.66,50.66 68.66,50.66 68.57,50.52 67.01,43.08 66.84,43.04 66.44,43.04 66.3,42.99 66.3,39.19 66.23,39.05 64.63,39.05 64.53,38.95 64.53,18.62 64.39,18.56 63.39,18.56 63.23,18.6 63.23,24.93 63.17,25.06 62.37,25.06 62.22,25.11 62.22,28.11 62.03,28.12 61.63,28.12 61.45,28.14 61.45,31.34 61.36,31.45 60.96,31.45 60.91,31.63 59.87,38.15 59.83,38.05 58.8,31.54 58.67,31.45 58.27,31.45 58.2,31.32 58.2,28.32 58.2,28.12 57.6,28.14 57.52,28.02 57.52,25.22 57.46,25.07 56.66,25.06 56.57,24.95 56.57,20.55 56.55,20.37 54.55,20.37 54.54,20.56 54.54,27.96 54.52,28.13 53.52,28.13 53.44,28.25 53.44,31.25 53.3,31.31 52.7,31.31 52.59,31.4 52.59,34.6 52.55,34.76 52.15,34.76 52.03,34.85 50.86,41.76 50.83,41.58 49.7,34.87 49.6,34.76 49.2,34.76 49.05,34.71 49.05,31.31 48.45,31.32 48.31,31.27 48.31,28.27 48.23,28.14 47.43,28.13 47.27,28.09 47.27,20.49 47.2,20.37 45,20.37 45,24.77 44.99,24.96 43.99,24.96 43.98,25.15 43.98,27.95 43.85,28.02 43.25,28.02 43.21,28.18 43.21,31.18 43.18,31.35 42.78,31.35 42.68,31.47 41.64,37.99 41.61,38.01 40.57,31.49 40.49,31.35 40.09,31.35 39.97,31.27 39.97,28.07 39.82,28.02 39.42,28.03 39.28,27.97 39.28,24.97 39.08,24.97 38.48,24.96 38.33,24.91 38.33,20.51 38.32,20.32 38.32,17.32 38.15,17.29 36.35,17.29 36.3,17.43 36.3,56.83 36.16,56.9 24.75,56.9 24.6,56.84 24.6,23.51 24.27,23.38 23.74,23.38 23.66,23.5 23.66,47.03 23.57,49.69 22.37,49.69 22.28,49.79 21.01,49.74 21.05,56.85 15.83,61.36 10.45,56.97 10.32,53.16 10.31,52.98 10.31,49.72 8.87,49.68 7.67,49.68 7.6,47.01 7.6,32.69 7.55,31.27 6.8,31.45 6.8,56.24 6.61,56.25 4.21,56.25 5.54,58 5.64,58.16
  pour Top (rank 3): 46.74,54.99 53.97,54.99 55.12,53.72 55.12,46.61 47.88,46.61 46.61,47.75
  pour Top (rank 3): 277 corners
  pour Top (rank 3): 294 corners
LED1  (via drill 0.35)
  Top 0.152: U1.39 52.55,57.63 v59.69,64.77 | v91.44,74.93 91.72,74.93 LED1.A
  Bottom 0.152: v59.69,64.77 69.85,74.93 v91.44,74.93
LED2  (via drill 0.35)
  Top 0.152: U1.40 52.04,60.93 v55.88,64.77 | v71.12,93.98 LED2.A
  Bottom 0.152: v55.88,64.77 55.88,78.74 v71.12,93.98
LED3  (via drill 0.35)
  Top 0.152: U1.41 51.56,64.26 v52.07,64.77 | v48.26,99.06 LED3.A
  Bottom 0.152: v52.07,64.77 52.07,95 v48.26,99.06
LED4  (via drill 0.35)
  Top 0.152: U1.43 50.55,59.94 v49.53,60.96 | v25.4,91.44 LED4.A
  Bottom 0.152: v25.4,91.44 25.4,89.48 27.76,87.12 27.76,82.73 v49.53,60.96
LED5  (via drill 0.35)
  Top 0.152: v7.62,71.12 LED5.A | U1.45 49.55,58.3 v49.43,58.42
  Bottom 0.152: v49.43,58.42 36.73,71.12 v7.62,71.12
LED6  (via drill 0.35)
  Top 0.152: U1.46 49.05,56.36 v48.26,57.15 | v2.54,48.26 LED6.A
  Bottom 0.152: v48.26,57.15 12.7,57.15 3.81,48.26 v2.54,48.26
LED7  (via drill 0.35)
  Top 0.152: LED7.A v10.16,25.4 | U1.38 53.06,56.87 v53.34,57.15
  Bottom 0.152: v10.16,25.4 22.45,25.4 42.52,45.47 45.47,45.47 53.34,53.34 v53.34,57.15
LED8  (via drill 0.35)
  Top 0.152: U1.21 52.04,39.39 v52.07,39.37 | LED8.A v30.48,7.62
  Bottom 0.152: v52.07,39.37 51.42,38.72 49.29,38.72 30.48,19.91 v30.48,7.62
LED9  (via drill 0.35)
  Top 0.152: U1.22 52.55,40.16 v54.61,38.1 | v53.34,2.54 LED9.A
  Bottom 0.152: v54.61,38.1 63.19,29.51 67.86,29.51 73,24.38 73,23.88 65.94,16.82 65.94,13.49 54.99,2.54 v53.34,2.54
LED10  (via drill 0.35)
  Top 0.152: LED10.A v80.15,15.1 81.64,16.59 U2.2 | U1.25 58.62,48.06 v59.69,46.99
  Bottom 0.152: v59.69,46.99 59.69,35.56 65.43,29.82 67.99,29.82 73.3,24.51 73.3,21.95 v80.15,15.1
LED11  (via drill 0.35)
  Top 0.152: U1.26 61.95,48.54 v63.5,46.99 | v93.98,30.48 LED11.A
  Bottom 0.152: v63.5,46.99 76.2,46.99 92.71,30.48 v93.98,30.48
LED12  (via drill 0.35)
  Top 0.152: U1.27 61.44,49.05 v63.5,50.8 | v99.06,53.34 LED12.A
  Bottom 0.152: v63.5,50.8 66.04,53.34 v99.06,53.34
LIGHT_SENSE  (via drill 0.35)
  Top 0.152: U3.E 16.5,56.23 R13.2 16.6,53.25 v21.59,48.26 | U1.10 45.85,49.05 43.43,46.63 41.55,46.63 v39.37,44.45
  Bottom 0.152: v21.59,48.26 25.4,44.45 v39.37,44.45
M_CS  (via drill 0.35)
  Top 0.152: U1.14 48.54,43.89 47.35,42.7 47.35,28.3 v45.72,26.67 | v71.12,24.13 72.67,25.68 U4.1
  Bottom 0.152: v45.72,26.67 68.58,26.67 v71.12,24.13
MISO
  Top 0.152: U4.2 73.41,26.56 73.87,26.56 74,26.43 74,23.2 J1.T_MISO | J1.MISO 52.38,16.2 52.38,35.68 49.67,38.39 49.67,46.47 U1.16
  Bottom 0.152: J1.MISO 55.5,13.97 56.67,15.14 62.71,15.14 63.88,13.97 J1.T_MISO
MOSI  (via drill 0.35)
  Top 0.152: J1.MOSI 47.88,13.97 49.45,12.39 59.77,12.39 61.34,13.97 J1.T_MOSI | U4.5 65.27,29.1 64.82,29.1 64.38,28.66 64.38,17.82 63.37,16.81 54.91,16.81 v54.61,16.51 52.68,18.44 52.68,35.8 50.18,38.31 50.18,46.44 U1.17
  Bottom 0.152: v54.61,16.51 49.53,16.51 J1.MOSI
N$1
  Top 0.152: LED1.C 92.24,72.16 R1.2
N$2
  Top 0.152: LED2.C R2.2
N$3
  Top 0.152: LED3.C 51.55,99.16 R3.2
N$4
  Top 0.152: LED4.C 29.69,91.98 R4.2
N$5
  Top 0.152: LED5.C 9.91,74.31 R5.2
N$6
  Top 0.152: LED6.C 4.98,51.55 R6.2
N$7
  Top 0.152: LED7.C R7.2
N$8
  Top 0.152: LED8.C R8.2
N$9
  Top 0.152: LED9.C 49.95,2.64 R9.2
N$10
  Top 0.152: R22.2 24.53,19.92 19.31,19.92 18.93,19.53 U$5.P$2
N$11
  Top 0.152: R23.2 28.89,21.21 27.14,19.46 19.77,19.46 19.39,19.07 U$5.P$3
N$12
  Top 0.152: R21.2 33.44,31.88 U$1.3
N$13
  Top 0.152: 39.37,11.43 62.23,11.43
N$14  (via drill 0.35)
  Top 0.152: 39.37,8.89 v56.77,8.89 v59.56,8.89 62.23,8.89
N$15
  Top 0.152: R17.1 51.65,26.5 Q1.1
N$16
  Top 0.152: R19.1 31.43,25.5 IC1.5
N$17
  Top 0.152: R24.2 43.69,61.3 JP1.2
N$18
  Top 0.152: 39.37,6.35 62.23,6.35
N$19
  Top 0.152: C12.1 32.89,48.26 32.96,48.32 Q2.1 35.69,51.05 U1.6
N$20
  Top 0.152: 39.37,7.62 62.23,7.62
N$21
  Top 0.152: C13.1 32.89,53.34 32.96,53.28 Q2.2 34.67,51.56 U1.5
N$22
  Top 0.152: R18.1 27.42,37.77 LED15.C
N$23
  Top 0.152: R18.2 31.33,31.88 IC1.1
N$24
  Top 0.152: R10.2 LED10.C
N$25
  Top 0.152: R11.2 LED11.C
N$26
  Top 0.152: LED12.C 96.62,50.05 R12.2
N$27  (via drill 0.35)
  Top 0.152: 39.37,10.16 v58.29,10.16 62.23,10.16
N$28
  Top 0.152: LED13.A 70.19,41.76 R20.1
N$29
  Top 0.152: U$1.1 35.24,35.46 R21.1 31.35,39.34 C7.1 29.42,41.3 S1.1
N$30  (via drill 0.35)
  other vias: 40.77,8.25
N$31  (via drill 0.35)
  other vias: 43.43,8.25
N$32  (via drill 0.35)
  other vias: 46.1,10.79
N$33  (via drill 0.35)
  other vias: 48.77,10.79
N$34  (via drill 0.35)
  other vias: 51.43,9.52
N$35  (via drill 0.35)
  other vias: 54.23,9.52
N$36  (via drill 0.35)
  other vias: 60.83,10.79
N$37
  pour Top: 49.15,11.18 49.15,10.41 60.58,10.41 60.58,11.18
N$38
  pour Top: 51.69,8.89 51.69,10.03 53.97,10.03 53.97,8.89
N$39
  pour Top: 40.64,8.89 43.43,8.89 43.43,7.62 40.64,7.62
N$40
  pour Top: 46.1,11.43 48.77,11.43 48.77,10.16 46.1,10.16
N$41
  Top 0.152: U1.44 50.04,59.18 47.75,61.47 R24.1
N$42
  Top 0.152: U1.2 42.19,53.06 PC13.TP
N$43
  pour Top: 7.62,41.15 23.62,41.15 23.62,39.5 7.62,39.5
NOT  (via drill 0.35)
  Top 0.152: U1.28 55.11,49.65 v59.69,49.65 | v85.09,20.32 85.09,18.98 U2.4
  Bottom 0.152: v85.09,20.32 85.09,24.25 v59.69,49.65
NS1
  Top 0.152: J1.LED 52.07,23.03 Q1.3
RST
  Top 0.152: RST.TP R16.1 40.81,50.55 U1.7
RX1  (via drill 0.35)
  Top 0.152: U1.31 55.86,51.05 55.98,51.17 60.59,51.17 v60.96,50.8
  Bottom 0.152: v60.96,50.8 63.86,47.9 76.15,47.9 81.09,42.96 JP2.1
SCK
  Top 0.152: U4.6 65.27,27.83 64.82,27.83 64.68,27.7 64.68,25.64 64.74,24.31 64.74,17.75 63.5,16.51 59.69,16.51 J1.T_SCK 55.88,12.7 50.8,12.7 J1.SCK 47.65,15.85 47.65,42.57 49.05,43.97 U1.15
SWCLK
  Top 0.152: SWDIO.TP 63.61,58.42 62.63,59.4 57.92,59.4 U1.37
SWDIO
  Top 0.152: U1.34 55.16,52.69 60.43,52.69 63.61,55.88 SWCLK.TP
T_CS  (via drill 0.35)
  Top 0.152: U1.11 46.47,48.42 45.75,48.42 38.1,40.77 v38.1,16.51
  Bottom 0.152: v38.1,16.51 39.47,15.14 39.85,15.14 40.74,14.25 40.74,13.49 41.53,12.7 58.42,12.7 J1.T_CS
T_IRQ  (via drill 0.35)
  Top 0.152: U1.29 55.16,50.18 55.85,50.18 55.93,50.26 v58.42,50.26 | v74.93,21.59 J1.T_IRQ
  Bottom 0.152: v74.93,21.59 74.93,33.75 59.63,49.05 59.44,49.05 59.08,49.4 59.08,49.6 v58.42,50.26
TFT_CS
  Top 0.152: U1.13 39.37,37.9 J1.CS
TFT_DC
  Top 0.152: U1.12 39.06,40.54 39.06,15.32 38.2,14.45 38.2,13.49 38.89,12.8 39.27,12.8 39.37,12.7 43.18,12.7 J1.D/C
TFT_LED  (via drill 0.35)
  Top 0.152: U1.18 50.55,38.37 v55.89,33.03 | R17.2 49.95,32.6 v49.53,33.02
  Bottom 0.152: v49.53,33.02 v55.88,33.02 v55.89,33.03
TFT_RST  (via drill 0.35)
  Top 0.152: J1.RESET 41.91,29.72 v41.53,30.1 | U1.19 51.05,38.99 v59.94,30.1
  Bottom 0.152: v41.53,30.1 v59.94,30.1
TX1  (via drill 0.35)
  Top 0.152: U1.30 55.78,50.55 56.11,50.87 59.75,50.87 v60.96,49.65
  Bottom 0.152: v60.96,49.65 63.02,47.6 76.02,47.6 84.05,39.57 JP3.2
USB+  (via drill 0.35)
  Top 0.152: R15.1 R23.1 31.33,24.03 32.06,24.75 32.06,26.98 v33.02,27.94 | v53.34,52.07 54.99,52.07 U1.33
  Bottom 0.152: v53.34,52.07 53.34,51.66 52.73,51.05 52.73,47.65 v33.02,27.94
USB-  (via drill 0.35)
  Top 0.152: R22.1 29.17,22.86 v29.21,22.86 | v53.34,50.8 54.1,51.56 U1.32
  Bottom 0.152: v29.21,22.86 53.34,46.99 v53.34,50.8

### Text on the board
tNames: On | GND | RX | TX | GND | Off | VCC